# EasyEDA schematic DAQS_Respaldo.json
TITLE: Banquihno Respaldihno; REV: 1.0; Date: 2023-11-27; Sheet: 1/1; Drawn By: Carlos A, Lidia M.; Company: Propulsion UNAM
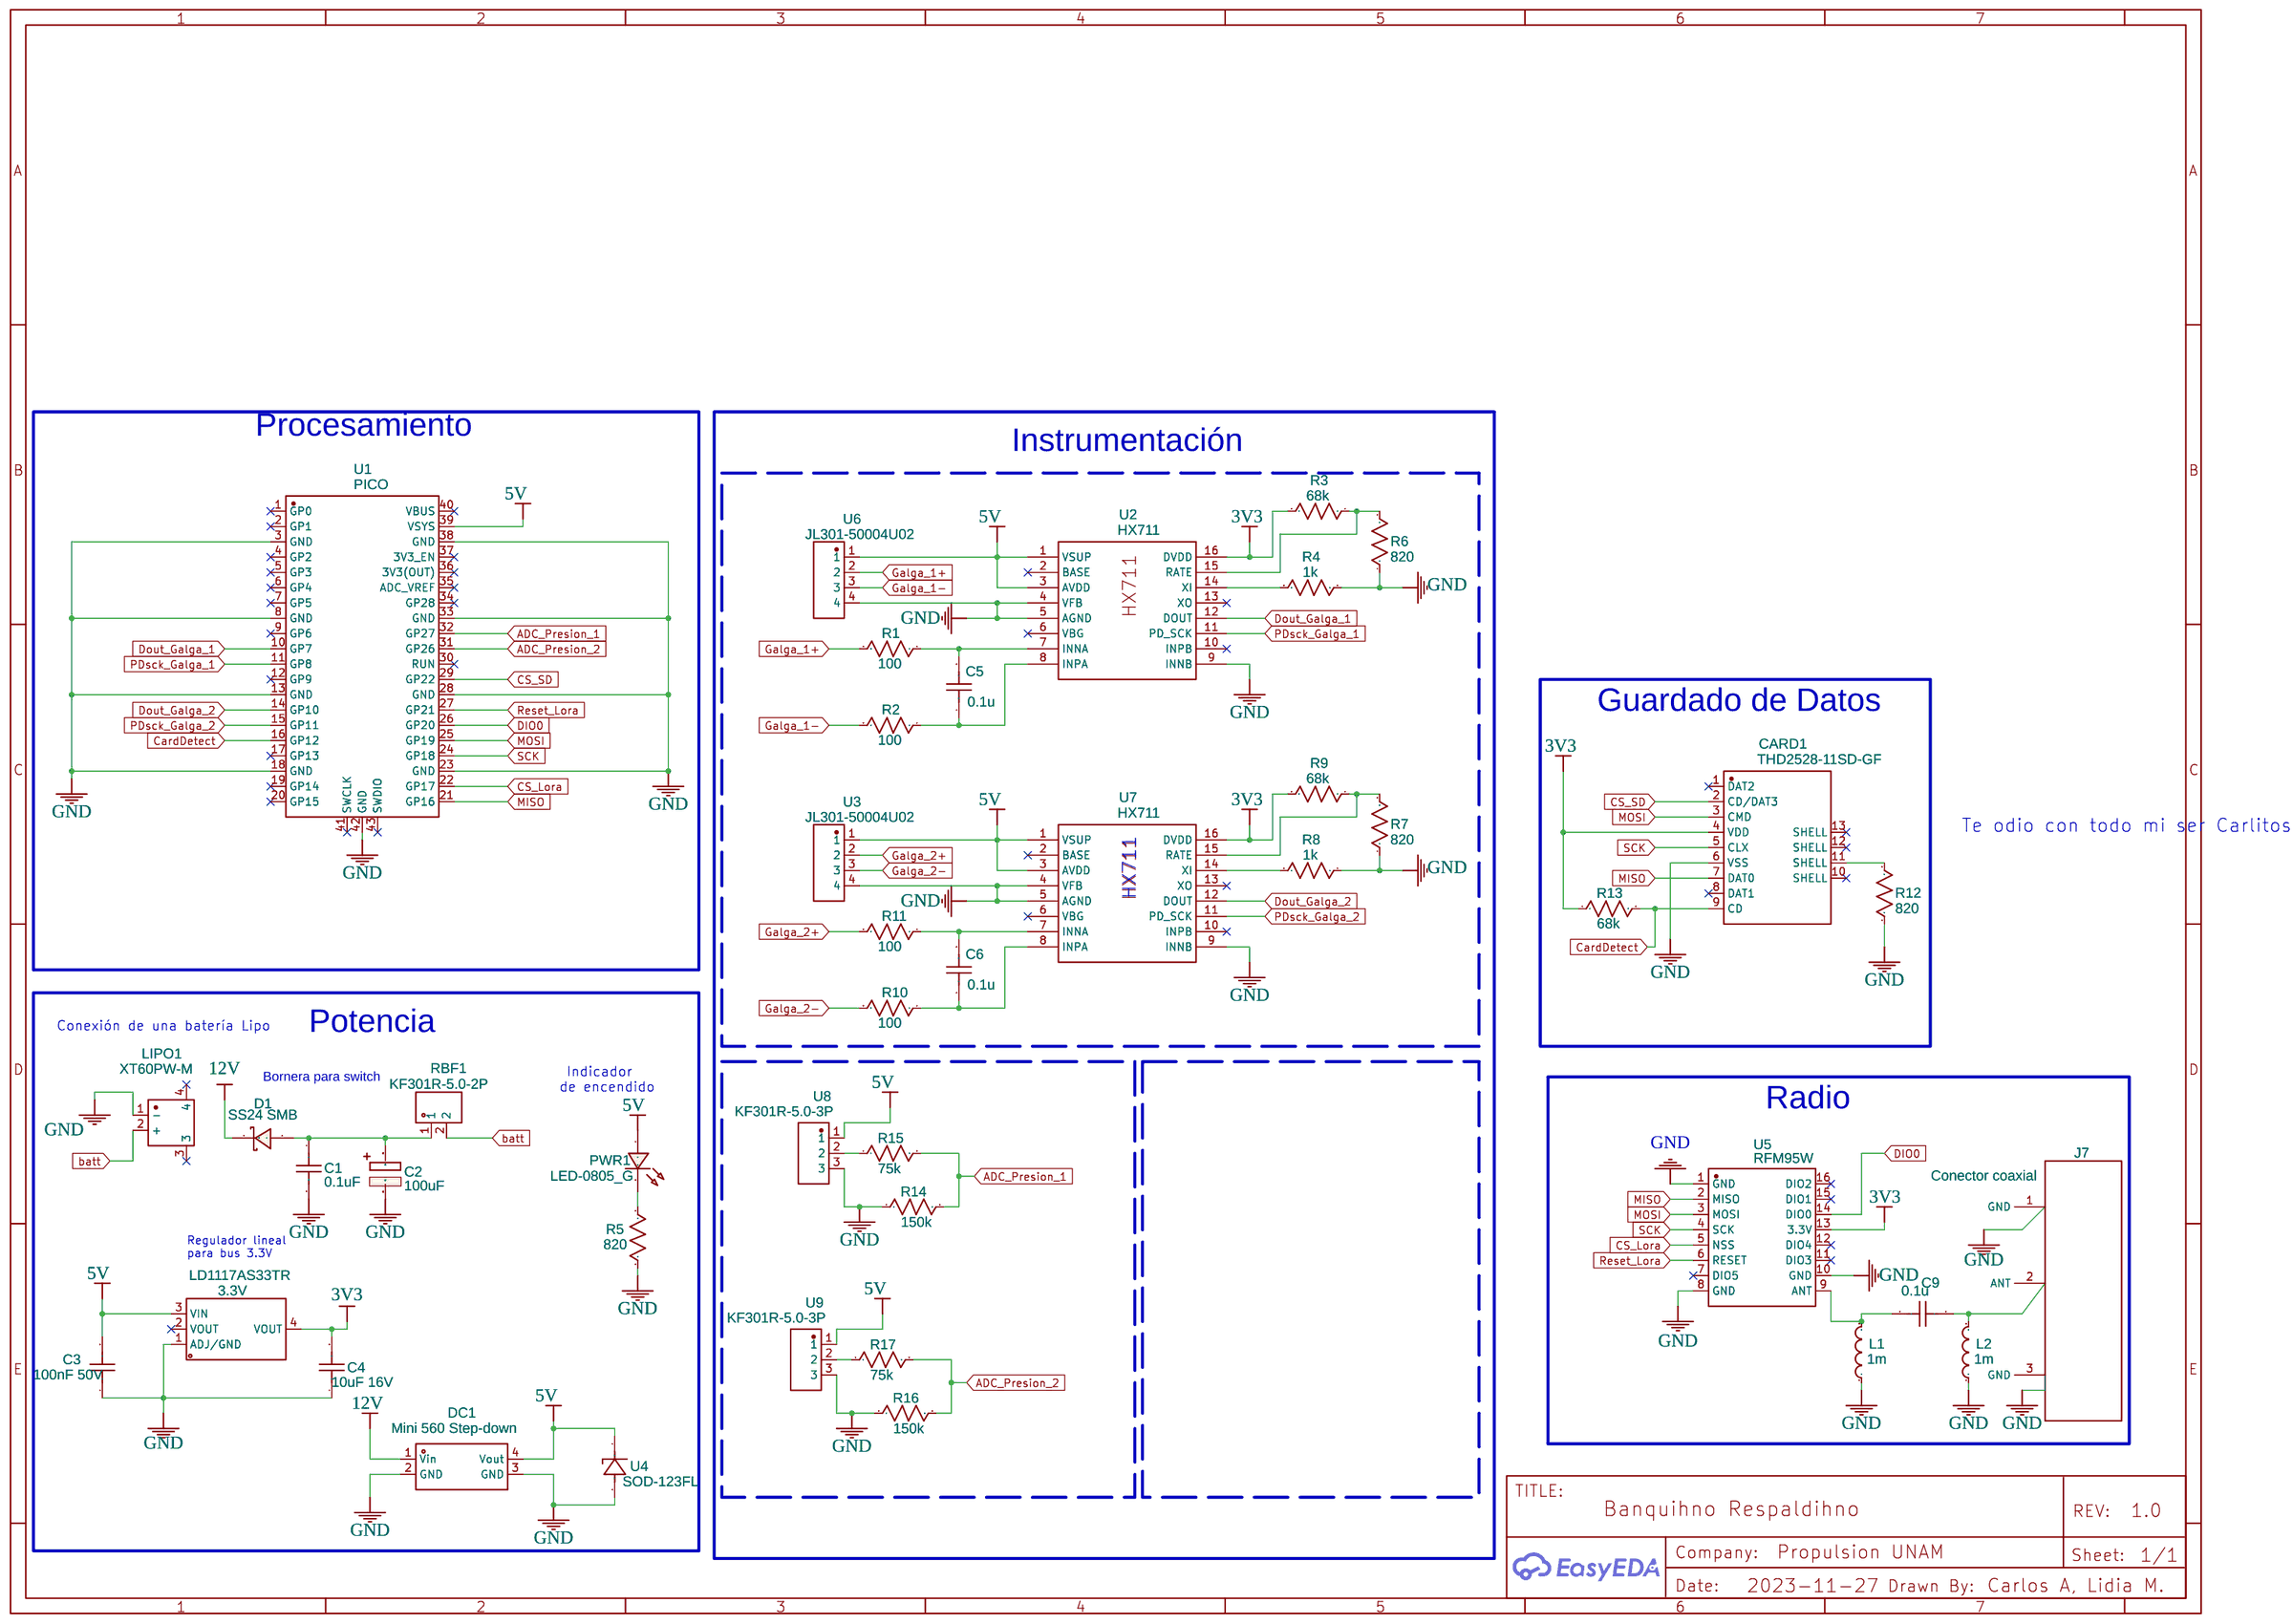
[diagram p0: schematic sheet]

## Parts
3.3V  LD1117AS33TR  [SOT-223-4_L6.5-W3.5-P2.30-LS7.0-BR]
C1  0.1uF  [C0805]
C2  100uF  [CAPACITOR-P-6MM]
C3  100nF 50V  [C0805]
C4  10uF 16V  [C0805]
C5  0.1u  [C0805]
C6  0.1u  [C0805]
C9  0.1u  [C0805]
CARD1  THD2528-11SD-GF  [TF-SMD_THD2528-11SD-GF]
D1  SS24 SMB  [SS24 SMB]
DC1  Mini 560 Step-down  [MINI 560]
J7  Conector coaxial  [CABLE COAXIAL]
L1  1m  [L0805]
L2  1m  [L0805]
LIPO1  XT60PW-M  [CONN-TH_XT60PW-M]
PWR1  LED-0805_G  [LED0805_GREEN]
R1  100  [R0805]
R2  100  [R0805]
R3  68k  [R0805]
R4  1k  [R0805]
R5  820  [R0805]
R6  820  [R0805]
R7  820  [R0805]
R8  1k  [R0805]
R9  68k  [R0805]
R10  100  [R0805]
R11  100  [R0805]
R12  820  [R0805]
R13  68k  [R0805]
R14  150k  [R0805]
R15  75k  [R0805]
R16  150k  [R0805]
R17  75k  [R0805]
RBF1  KF301R-5.0-2P  [CONN-TH_P5.00_KF301R-5.0-2P]
U1  PICO  [COMM-SMD_L51.0-W21.0-P2.54_SC0916]
U2  HX711  [SOP-16_L10.0-W3.9-P1.27-LS6.0-BL]
U3  JL301-50004U02  [CONN-TH_4P-P5.00_JL301-50004U02]
U4  SOD-123FL  [SOD-123F_L2.7-W1.7-LS3.7-RD]
U5  RFM95W  [COMM-SMD_RFM95W]
U6  JL301-50004U02  [CONN-TH_4P-P5.00_JL301-50004U02]
U7  HX711  [SOP-16_L10.0-W3.9-P1.27-LS6.0-BL]
U8  KF301R-5.0-3P  [CONN-TH_3P-P5.00_KF301R-5.0-3P]
U9  KF301R-5.0-3P  [CONN-TH_3P-P5.00_KF301R-5.0-3P]

## Library data of the parts
3.3V = LD1117AS33TR: Supplier: LCSC; Supplier Part: C115288; Manufacturer: STMicroelectronics; Contributor: LCSC; JLCPCB Part Class: Extended Part
C1 C3-C6 C9 = C_0805_US: Contributor: LCEDA_Lib
C2 = CAP-P-6MM: Contributor: MrHugh
CARD1 = THD2528-11SD-GF: Contributor: LCSC; Supplier: LCSC; Supplier Part: C283232; Manufacturer: THD(台华达); JLCPCB Part Class: Extended Part
D1 = SS24 SMB: Supplier: Lazada; Contributor: LCSC
DC1 = Mini 560 Step-down: link: https://www.aliexpress.com/item/1005001886607681.html?af=485352&utm_campaign=485352&aff_platform=portals-tool&utm_medium=cpa&afref=https%3A%2F%2Ftrade.aliexpress.com%2F&dp=c4e8c4d9232c4490e6340f5fdbe51870&aff_fcid=53df7bc6a37e46f7821b7ed16f014540-1621422597839-04855-_ePNSNV&spm=a2g0s.9042311.0.0.27424c4drrNQiA&cv=47843&aff_fsk=_ePNSNV&pvid=c565eb42-c92d-4408-b7c7-b12bcfd95518&mall_affr=pr3&sk=_ePNSNV&aff_trace_key=53df7bc6a37e46f7821b7ed16f014540-1621422597839-04855-_ePNSNV&rmsg=do_not_replacement&scm=1007.23534.123999.0&terminal_id=674dbcc2ae264b0e977ba0c56c9ad208&utm_source=admitad&utm_content=47843; Contributor: Wouterv8x
J7 = Conector coaxial: Contributor: santiagoarroyo; Package Display: No
L1 L2 = L0805_US: Contributor: LCEDA_Lib
LIPO1 = XT60PW-M: Contributor: LCSC; Supplier: LCSC; Supplier Part: C98732; Manufacturer: AMASS(艾迈斯); JLCPCB Part Class: Extended Part
PWR1 = LED-0805_G: Manufacturer: 国星光电; Manufacturer Part: NCD0805G1; Supplier Part: C84260; Contributor: LCEDA_Lib
R1-R17 = R_0805_US: Contributor: LCEDA_Lib
RBF1 = KF301R-5.0-2P: Supplier: LCSC; Supplier Part: C474883; Manufacturer: Cixi Kefa Elec; Contributor: LCSC; JLCPCB Part Class: Extended Part
U1 = PICO: Supplier: LCSC; Supplier Part: C7203002; Manufacturer: Raspberry Pi(树莓派); JLCPCB Part Class: Extended Part; Contributor: lcsc
U2 U7 = HX711: Supplier: LCSC; Manufacturer: AVIA(海芯科技); Supplier Part: C43656; JLCPCB Part Class: Extended Part
U3 U6 = JL301-50004U02: Contributor: LCSC; Supplier: LCSC; Supplier Part: C409137; Manufacturer: JILN(锦凌); JLCPCB Part Class: Extended Part
U4 = SOD-123FL: Contributor: LCSC; Supplier: LCSC; Supplier Part: C9900012798; Manufacturer: null; JLCPCB Part Class: Extended Part
U5 = RFM95W: Contributor: LCSC; Supplier: LCSC; Supplier Part: C9900000484; JLCPCB Part Class: Extended Part; Manufacturer: null
U8 U9 = KF301R-5.0-3P: Contributor: LCSC; Supplier: LCSC; Supplier Part: C474884; Manufacturer: KEFA(科发); JLCPCB Part Class: Extended Part

## Nets
3V3: 3.3V.4(VOUT) C4.2 CARD1.4(VDD) R3.2 R9.2 R13.1 U2.16(DVDD) U5.13(3.3V) U7.16(DVDD)
5V: 3.3V.3(VIN) C3.2 DC1.4(Vout) PWR1.1 U1.39(VSYS) U2.1(VSUP) U2.3(AVDD) U3.1 U4.1(C) U6.1 U7.1(VSUP) U7.3(AVDD) U8.1 U9.1
12V: D1.1(C) DC1.1(Vin)
GND: 3.3V.1(ADJ/GND) C1.2 C2.P$1(-) C3.1 C4.1 CARD1.6(VSS) DC1.2(GND) DC1.3(GND) J7.1(GND) J7.3(GND) L1.1 L2.1 LIPO1.1(-) R4.1 R5.2 R6.1 R7.1 R8.1 R12.1 R14.1 R16.1 U1.3(GND) U1.8(GND) U1.13(GND) U1.18(GND) U1.23(GND) U1.28(GND) U1.33(GND) U1.38(GND) U1.42(GND) U2.4(VFB) U2.5(AGND) U2.9(INNB) U3.4 U4.2(A) U5.1(GND) U5.8(GND) U5.10(GND) U6.4 U7.4(VFB) U7.5(AGND) U7.9(INNB) U8.3 U9.3
ADC_Presion_1: R14.2 R15.2 U1.32(GP27)
ADC_Presion_2: R16.2 R17.2 U1.31(GP26)
batt: LIPO1.2(+) RBF1.2
CardDetect: CARD1.9(CD) R13.2 U1.16(GP12)
CS_Lora: U1.22(GP17) U5.5(NSS)
CS_SD: CARD1.2(CD/DAT3) U1.29(GP22)
DIO0: U1.26(GP20) U5.14(DIO0)
Dout_Galga_1: U1.10(GP7) U2.12(DOUT)
Dout_Galga_2: U1.14(GP10) U7.12(DOUT)
Galga_1+: R1.2 U6.2
Galga_1-: R2.2 U6.3
Galga_2+: R11.2 U3.2
Galga_2-: R10.2 U3.3
MISO: CARD1.7(DAT0) U1.21(GP16) U5.2(MISO)
MOSI: CARD1.3(CMD) U1.25(GP19) U5.3(MOSI)
PDsck_Galga_1: U1.11(GP8) U2.11(PD_SCK)
PDsck_Galga_2: U1.15(GP11) U7.11(PD_SCK)
Reset_Lora: U1.27(GP21) U5.6(RESET)
SCK: CARD1.5(CLX) U1.24(GP18) U5.4(SCK)
Net-(C1-1): C1.1 C2.P$2(+) D1.2(A) RBF1.1
Net-(C5-1): C5.1 R2.1 U2.8(INPA)
Net-(C5-2): C5.2 R1.1 U2.7(INNA)
Net-(C6-1): C6.1 R10.1 U7.8(INPA)
Net-(C6-2): C6.2 R11.1 U7.7(INNA)
Net-(C9-1): C9.1 L1.2 U5.9(ANT)
Net-(C9-2): C9.2 J7.2(ANT) L2.2
Net-(CARD1-11): CARD1.11(SHELL) R12.2
Net-(PWR1-2): PWR1.2 R5.1
Net-(R3-1): R3.1 R6.2 U2.15(RATE)
Net-(R4-2): R4.2 U2.14(XI)
Net-(R7-2): R7.2 R9.1 U7.15(RATE)
Net-(R8-2): R8.2 U7.14(XI)
Net-(R15-1): R15.1 U8.2
Net-(R17-1): R17.1 U9.2

Not connected (* = marked no-connect by the designer): 3.3V 2(VOUT)*; CARD1 1(DAT2)* 8(DAT1)* 10(SHELL)* 12(SHELL)* 13(SHELL)*; LIPO1 3* 4*; U1 1(GP0)* 2(GP1)* 4(GP2)* 5(GP3)* 6(GP4)* 7(GP5)* 9(GP6)* 12(GP9)* 17(GP13)* 19(GP14)* 20(GP15)* 30(RUN)* 34(GP28)* 35(ADC_VREF)* 36(3V3(OUT))* 37(3V3_EN)* 40(VBUS)* 41(SWCLK)* 43(SWDIO)*; U2 2(BASE)* 6(VBG)* 10(INPB)* 13(XO)*; U5 7(DIO5)* 11(DIO3)* 12(DIO4)* 15(DIO1)* 16(DIO2)*; U7 2(BASE)* 6(VBG)* 10(INPB)* 13(XO)*

## Notes on the sheet
- Procesamiento
- Instrumentación
- Guardado de Datos
- Te odio con todo mi ser Carlitos :D
- HX711
- Conexión de una batería Lipo
- Potencia
- Bornera para switch
- Indicador
- de encendido
- Radio
- Regulador lineal
  para bus 3.3V
